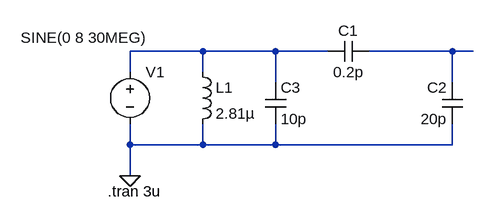
[diagram p0: schematic SQRL_Resonator_Capacitive_Divider.asc]
SQRL_Resonator_Capacitive_Divider.asc, the LTspice schematic file:
Version 4
SHEET 1 880 680
WIRE 64 32 -48 32
WIRE 176 32 64 32
WIRE 256 32 176 32
WIRE 448 32 320 32
WIRE 480 32 448 32
WIRE -48 64 -48 32
WIRE 64 64 64 32
WIRE 176 80 176 32
WIRE 448 80 448 32
WIRE -48 176 -48 144
WIRE 64 176 64 144
WIRE 64 176 -48 176
WIRE 176 176 176 144
WIRE 176 176 64 176
WIRE 448 176 448 144
WIRE 448 176 176 176
WIRE -48 224 -48 176
FLAG -48 224 0
SYMBOL voltage -48 48 R0
WINDOW 3 -168 -37 Left 2
WINDOW 123 24 124 Left 2
WINDOW 39 0 0 Left 0
SYMATTR InstName V1
SYMATTR Value SINE(0 8 30MEG)
SYMBOL cap 320 16 R90
WINDOW 0 0 32 VBottom 2
WINDOW 3 32 32 VTop 2
SYMATTR InstName C1
SYMATTR Value 0.2p
SYMBOL cap 464 144 R180
WINDOW 0 24 56 Left 2
WINDOW 3 24 8 Left 2
SYMATTR InstName C2
SYMATTR Value 20p
SYMBOL cap 160 80 R0
SYMATTR InstName C3
SYMATTR Value 10p
SYMBOL ind 48 48 R0
SYMATTR InstName L1
SYMATTR Value 2.81µ
TEXT -82 248 Left 2 !.tran 3u

The netlist it stands for:
* SQRL_Resonator_Capacitive_Divider.asc
V1 N001 0 SINE(0 8 30MEG)
C1 N002 N001 0.2p
C2 0 N002 20p
C3 N001 0 10p
L1 N001 0 2.81µ
.tran 3u
.backanno
.end